# EAGLE design main (EAGLE 7.6.0)
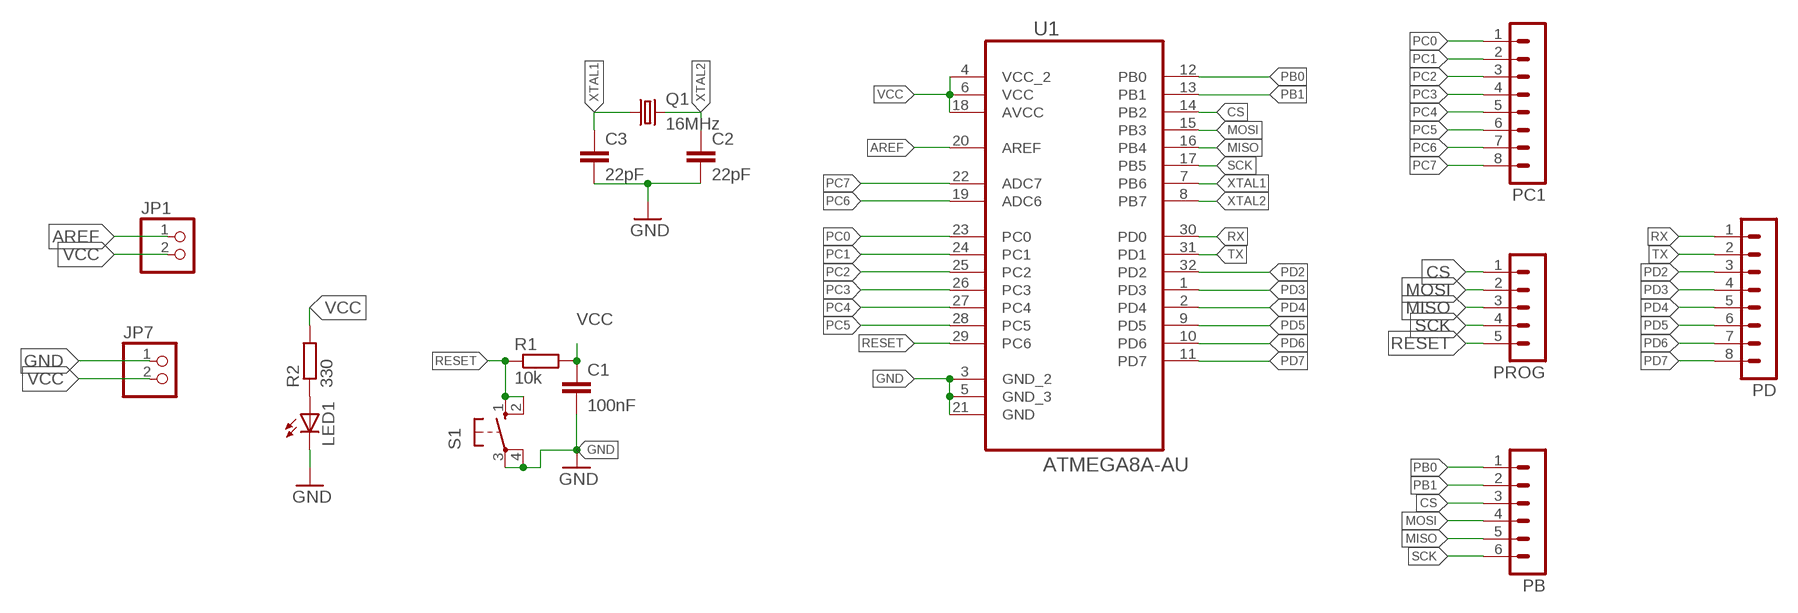
[diagram p0: schematic, sheet 1]

## Parts
C1  100nF  C-EU025-025X050  [C025-025X050]
C2  22pF  C-EU025-025X050  [C025-025X050]
C3  22pF  C-EU025-025X050  [C025-025X050]
JP1  PINHD-1X2  [1X02]
JP7  PINHD-1X2  [1X02]
LED1  LED3MM  [LED3MM]
PB  MA06-1  [MA06-1]
PC1  MA08-1  [MA08-1]
PD  MA08-1  [MA08-1]
PROG  MA05-1  [MA05-1]
Q1  16MHz  CRYSTALHC49S  [HC49/S]
R1  10k  R-EU_M0805  [M0805]
R2  330  R-EU_M0805  [M0805]
S1  10-XX  [B3F-10XX]
U1  ATMEGA8A-AU  [QFP80P900X900X120-32N]

## Nets
AREF: JP1.1 U1.20(AREF)
CS: PB.3 PROG.1 U1.14(PB2)
GND: C1.2 C2.2 C3.2 JP7.1 LED1.K(C) S1.3(P) S1.4(P1) U1.3(GND_2) U1.5(GND_3) U1.21(GND)
MISO: PB.5 PROG.3 U1.16(PB4)
MOSI: PB.4 PROG.2 U1.15(PB3)
N$1: LED1.A R2.1
PB0: PB.1 U1.12(PB0)
PB1: PB.2 U1.13(PB1)
PC0: PC1.1 U1.23(PC0)
PC1: PC1.2 U1.24(PC1)
PC2: PC1.3 U1.25(PC2)
PC3: PC1.4 U1.26(PC3)
PC4: PC1.5 U1.27(PC4)
PC5: PC1.6 U1.28(PC5)
PC6: PC1.7 U1.19(ADC6)
PC7: PC1.8 U1.22(ADC7)
PD2: PD.3 U1.32(PD2)
PD3: PD.4 U1.1(PD3)
PD4: PD.5 U1.2(PD4)
PD5: PD.6 U1.9(PD5)
PD6: PD.7 U1.10(PD6)
PD7: PD.8 U1.11(PD7)
RESET: PROG.5 R1.1 S1.1(S) S1.2(S1) U1.29(PC6)
RX: PD.1 U1.30(PD0)
SCK: PB.6 PROG.4 U1.17(PB5)
TX: PD.2 U1.31(PD1)
VCC: C1.1 JP1.2 JP7.2 R1.2 R2.2 U1.4(VCC_2) U1.6(VCC) U1.18(AVCC)
XTAL1: C3.1 Q1.1 U1.7(PB6)
XTAL2: C2.1 Q1.2 U1.8(PB7)

## Library data of the parts
C1-C3 = resistor:C-EU: CAPACITOR, European symbol
JP1 JP7 = pinhead:PINHD-1X2: PIN HEADER
LED1 = adafruit:LED: LED OSRAM: - CHIPLED LG R971, LG N971, LY N971, LG Q971, LY Q971, LO R971, LY R971 LH N974, LH R974 LS Q976, LO Q976, LY Q976 LO Q996 - Hyper CHIPLED LW Q18S LB Q993, LB Q99A, LB R99A - SideLED LS A670, LO A670, LY A670, LG A670, LP A670 LB A673, LV A673, LT A673, LW A673 LH A674 LY A675 LS A676, LA A676, LO A676, LY A676, LW A676 LS A679, LY A679, LG A679 - Hyper Micro SIDELED® LS Y876, LA Y876, LO Y876, LY Y876 LT Y87S - SmartLED LW L88C, LW L88S LB L89C, LB L89S, LG L890 LS L89K, LO L89K, LY L89K LS L896, LA L896, LO L896, LY L896 - TOPLED LS T670, LO T670, LY T670, LG T670, LP T670 LSG T670, LSP T670, LSY T670, LOP T670, LYG T670 LG T671, LOG T671, LSG T671 LB T673, LV T673, LT T673, LW T673 LH T674 LS T676, LA T676, LO T676, LY T676, LB T676, LH T676, LSB T676, LW T676 LB T67C, LV T67C, LT T67C, LS T67K, LO T67K, LY T67K, LW E67C LS E67B, LA E67B, LO E67B, LY E67B, LB E67C, LV E67C, LT E67C LW T67C LS T679, LY T679, LG T679 LS T770, LO T770, LY T770, LG T770, LP T770 LB T773, LV T773, LT T773, LW T773 LH T774 LS E675, LA E675, LY E675, LS T675 LS T776, LA T776, LO T776, LY T776, LB T776 LHGB T686 LT T68C, LB T68C - Hyper Mini TOPLED® LB M676 - Mini TOPLED Santana® LG M470 LS M47K, LO M47K, LY M47K Source: http://www.osram.convergy.de/
PB = con-lstb:MA06-1: PIN HEADER; OC_FARNELL: unknown; OC_NEWARK: unknown
PC1 PD = con-lstb:MA08-1: PIN HEADER; OC_FARNELL: unknown; OC_NEWARK: unknown
PROG = con-lstb:MA05-1: PIN HEADER; OC_FARNELL: unknown; OC_NEWARK: unknown
Q1 = crystal:CRYSTAL: CRYSTAL; OC_FARNELL: 1667008; OC_NEWARK: unknown
R1 = resistor:R-EU_: RESISTOR, European symbol
R2 = rcl:R-EU_: RESISTOR, European symbol
S1 = switch-omron:10-XX: OMRON SWITCH; MPN: B3F-1000; OC_FARNELL: 176432; OC_NEWARK: 36M3542
U1 = Atmel_By_element14_Batch_1-00:ATMEGA8A-AU: Programmable Flash; MPN: ATMEGA8A-AU; OC_FARNELL: 1748532; OC_NEWARK: 26R5638; PACKAGE: TQFP-32; SUPPLIER: Atmel

## Board
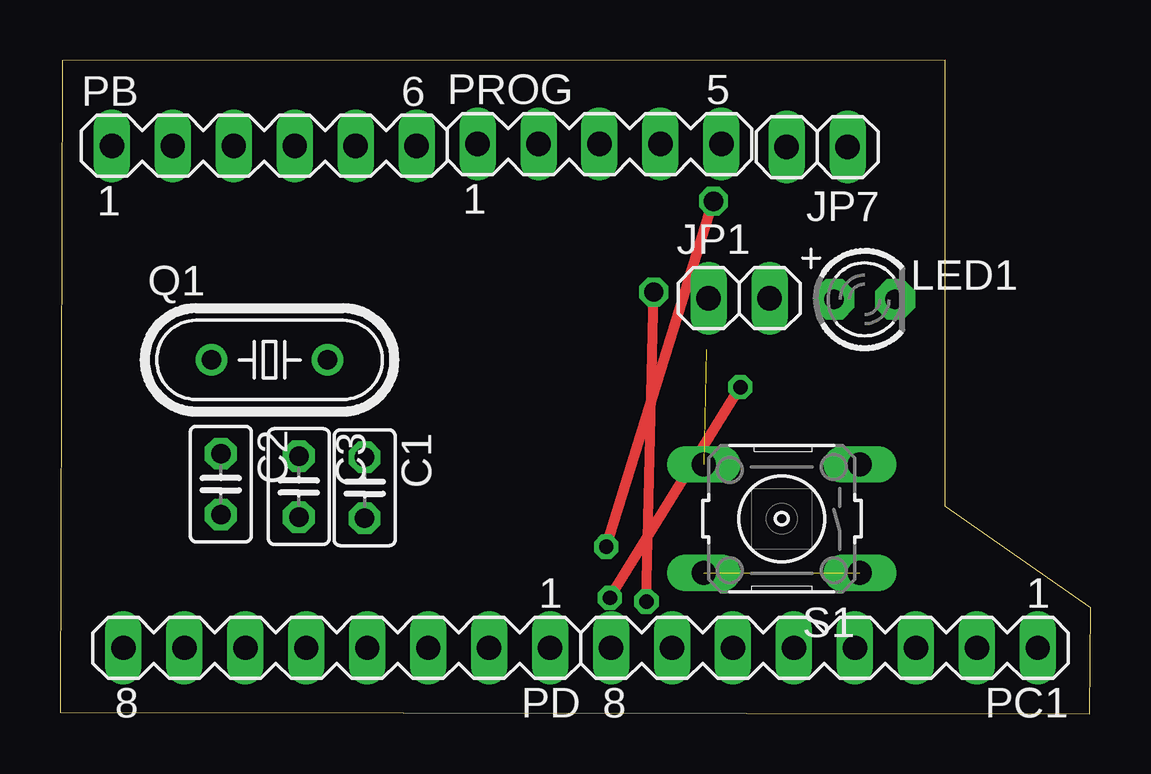
[diagram p1: board, top side]
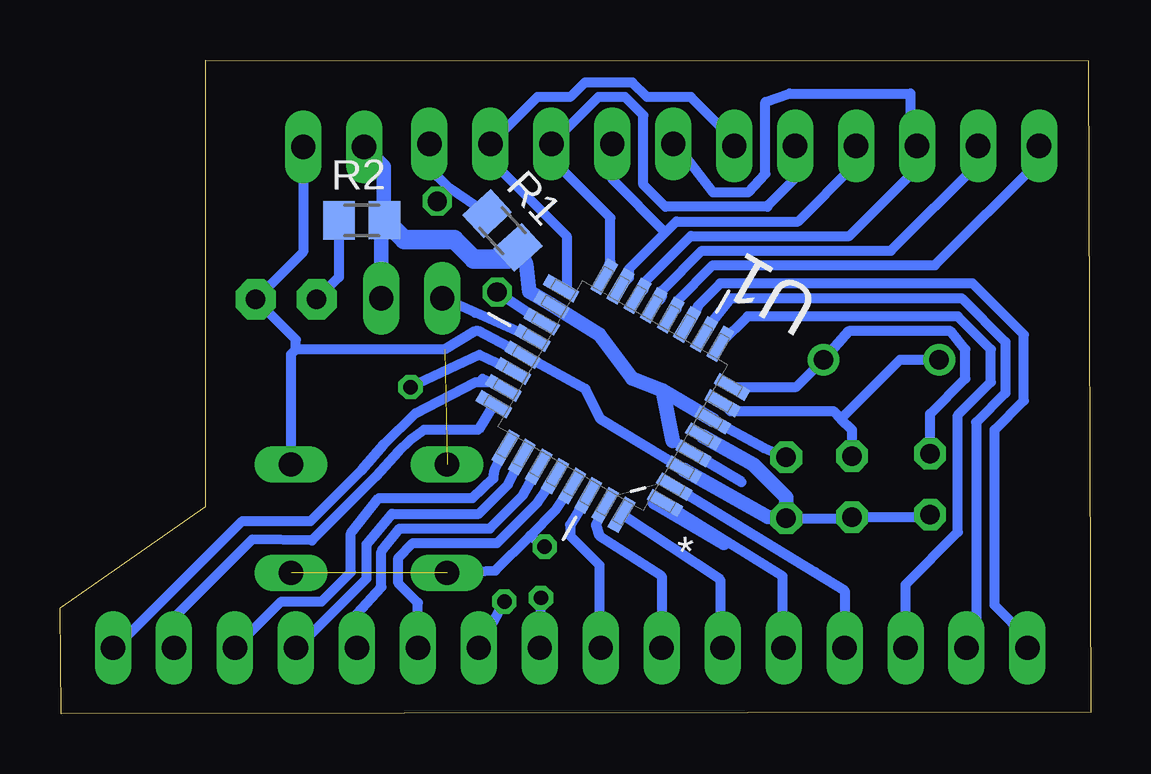
[diagram p2: board, bottom side, seen from below]

Size 42.95 x 27.25 mm. Coordinates in mm from the lower left corner, seen from the top.
Outline: 0,0.05 42.9,0 42.95,4.42 36.88,8.64 36.88,27.25 0.1,27.23 0,0.05
Copper layers (1*16): Top 0.035mm / dielectric 1.5mm / Bottom 0.035mm
Design rules "default": minimum track width 10mil, minimum drill 24mil, track to track 8mil, track to pad 8mil, pad to pad 8mil, via to via 8mil, smd to smd 8mil, copper to edge 40mil, drill to drill 8mil, minimum pad ring 10mil, minimum via ring 8mil, stop-mask expansion 4mil, vias tented up to drill 0mil, thermal gap 10mil

### Footprints (pad centres in the part's own frame; a part is rotated, then mirrored left to right if it is on the bottom)
C025-025X050 = drill 0.813 octagon: 1 -1.27,0; 2 1.27,0
1X02 = drill 1.016 long: 1 -1.27,0; 2 1.27,0
LED3MM = drill 0.813 pad 1.676 octagon: A -1.27,0; K 1.27,0
MA06-1 = drill 1.016 long: 1 -6.35,0; 2 -3.81,0; 3 -1.27,0; 4 1.27,0; 5 3.81,0; 6 6.35,0
MA08-1 = drill 1.016 long: 1 -8.89,0; 2 -6.35,0; 3 -3.81,0; 4 -1.27,0; 5 1.27,0; 6 3.81,0; 7 6.35,0; 8 8.89,0
MA05-1 = drill 1.016 long: 1 -5.08,0; 2 -2.54,0; 3 0,0; 4 2.54,0; 5 5.08,0
HC49/S = drill 0.813: 1 -2.413,0; 2 2.413,0
M0805 = smd 1.3 x 1.6: 1 -0.95,0; 2 0.95,0
B3F-10XX = drill 1.016 long: 1 -3.251,2.261; 2 3.251,2.261; 3 -3.251,-2.261; 4 3.251,-2.261
QFP80P900X900X120-32N = smd 1.473 x 0.508: 1 -4.115,2.794; 2 -4.115,2.007; 3 -4.115,1.194; 4 -4.115,0.406; 5 -4.115,-0.406; 6 -4.115,-1.194; 7 -4.115,-2.007; 8 -4.115,-2.794; 17 4.115,-2.794; 18 4.115,-2.007; 19 4.115,-1.194; 20 4.115,-0.406; 21 4.115,0.406; 22 4.115,1.194; 23 4.115,2.007; 24 4.115,2.794 | smd 0.508 x 1.473: 9 -2.794,-4.115; 10 -2.007,-4.115; 11 -1.194,-4.115; 12 -0.406,-4.115; 13 0.406,-4.115; 14 1.194,-4.115; 15 2.007,-4.115; 16 2.794,-4.115; 25 2.794,4.115; 26 2.007,4.115; 27 1.194,4.115; 28 0.406,4.115; 29 -0.406,4.115; 30 -1.194,4.115; 31 -2.007,4.115; 32 -2.794,4.115

### Placement (x,y rotation side)
C1  12.69,9.42 270 top
C2  6.7,9.57 270 top
C3  9.95,9.47 270 top
JP1  28.3,17.32 0 top
JP7  31.55,23.62 180 top
LED1  33.53,17.27 0 top
PB  8.51,23.67 0 top
PC1  31.85,2.74 180 top
PD  11.53,2.74 180 top
PROG  22.48,23.75 0 top
Q1  8.73,14.75 0 top
R1  24.51,20.14 312.5 bottom
R2  30.38,20.57 0.1 bottom
S1  30.07,8.13 180 top
U1  19.91,13.26 150 bottom

### Tracks (layer width: path | path; a pad name or v marks a point on that pad's centre or on a via)
AREF
  Bottom 0.406: U1.20 25.65,16.71 JP1.1
CS
  Bottom 0.406: U1.14 18.64,17.67 18.64,17.93 16.66,19.91 10.06,19.91 7.21,22.76 7.21,23.65 PB.3 7.52,23.95 7.52,25.86 12.55,25.86 13.56,25.5 13.56,22.5 14.28,21.74 15.75,21.74 17.3,23.75 PROG.1
GND  (1 unrouted)
  Bottom 0.406: C1.2 10,8.15 C3.2 6.8,8.2 C2.2 | U1.3 20.42,12.27 21.06,13.54 U1.21 25.5,15.95 25.65,15.95 26.92,15.19 33.12,15.19 | JP7.1 32.82,19.25 LED1.K 33.12,15.6 33.12,15.19 | S1.3 33.33,14.99 33.12,15.19
  Bottom 0.61: U1.5 14.07,10.39 12.69,9.01 C1.2 13.46,8.2 U1.3
MISO
  Bottom 0.406: U1.16 20.02,18.85 20.02,20.68 22.45,23.11 22.45,23.72 PROG.3 20.52,25.71 19.41,25.71 18.64,24.94 18.64,22.05 17.73,21.13 13.46,21.13 13.46,21.18 12.4,22.25 12.4,23.6 PB.5
MOSI
  Bottom 0.406: 17.73,20.07 17.27,20.52 12.19,20.52 9.86,22.86 9.86,23.6 PB.4 | 17.73,20.07 19.25,18.54 19.25,18.17 U1.15 | 17.73,20.07 19.94,22.28 PROG.2
N$1
  Bottom 0.406: R2.1 31.33,18.2 LED1.A
N$3
  Bottom 0.61: 18.16,8.81 15.29,7.11
PB0
  Bottom 0.406: U1.12 17.27,16.85 17.27,17.17 15.75,18.69 6.5,18.69 2.13,23.06 2.13,23.65 PB.1
PB1
  Bottom 0.406: U1.13 17.88,17.35 17.88,17.63 16.21,19.3 8.33,19.3 4.67,22.96 4.67,23.65 PB.2
PC0
  Bottom 0.406: PC1.1 40.64,2.74 35.36,8.03 32.51,8.03 30.38,10.16 29.46,11.23 28.14,12.52 25.63,13.82 25.03,13.82 | 25.35,13.97 25.03,13.82 | 25.03,13.82 U1.23
PC1
  Bottom 0.406: U1.24 25.53,11.84 27.79,11.83 28.35,11.43 28.85,10.92 29.77,9.91 32.46,7.21 34.95,7.26 38.15,4.06 38.15,2.79 PC1.2
PC2
  Bottom 0.406: PC1.3 33.73,4.67 32.06,4.67 30.84,5.89 30.84,7.52 29.67,8.99 25.76,8.99 24.89,9.8 24.84,10.16 U1.25
PC3
  Bottom 0.406: PC1.4 33.07,2.74 30.18,5.64 30.18,7.06 29.11,8.33 25.5,8.33 24.28,9.55 U1.26
PC4
  Bottom 0.406: PC1.5 30.58,4.17 29.57,5.28 29.57,6.76 28.8,7.72 25.04,7.72 23.67,9.09 U1.27
PC5
  Bottom 0.406: PC1.6 28.04,4.62 28.85,5.44 28.85,6.5 28.25,7.11 24.74,7.11 23.06,8.79 U1.28
PC6  (via drill 0.6, 0.8)
  Top 0.406: v24.44,4.67 v24.74,17.58
  Bottom 0.406: U1.19 v24.74,17.58 | v24.44,4.67 PC1.7
PC7  (via drill 0.6)
  Top 0.406: v22.91,4.83 v28.35,13.61
  Bottom 0.406: v22.91,4.83 PC1.8 | U1.22 25.48,14.96 v28.35,13.61
PD2
  Bottom 0.406: U1.32 15.44,5.59 15.44,2.85 PD.3
PD3
  Bottom 0.406: U1.1 12.85,5.74 12.85,2.79 PD.4
PD4
  Bottom 0.406: U1.2 11.48,5.89 10.26,5.13 PD.5
PD5
  Bottom 0.406: PD.6 7.72,5.39 5.54,7.57 5.54,12.45 4.17,13.82 4.17,15.19 5.54,16.56 14.3,16.56 U1.9
PD6
  Bottom 0.406: U1.10 16.12,15.89 14.99,17.32 5.39,17.32 3.56,15.49 3.56,13.36 4.78,12.14 4.78,3.15 PD.7
PD7
  Bottom 0.406: PD.8 2.64,3.15 4.01,4.52 4.01,11.84 2.79,13.06 2.79,15.8 4.93,17.93 15.44,17.93 16.36,17.02 U1.11
RESET  (via drill 0.6, 0.8 pad 1.02)  (1 unrouted)
  Top 0.406: v22.76,6.96 v27.23,21.36
  Bottom 0.406: S1.2 24.82,5.97 23.37,7.42 | 23.37,7.42 22.3,8.48 U1.29 | PROG.5 27.56,22.72 26.8,21.97 | 26.8,21.97 R1.1 | v27.23,21.36 26.8,21.97 | v22.76,6.96 23.37,7.42
RX
  Bottom 0.406: U1.30 21.69,7.87 21.69,7.42 20.47,6.2 20.47,2.79 PD.1
SCK
  Bottom 0.406: U1.17 21.84,17.72 21.84,19.91 25.02,23.09 PROG.4 23.06,25.71 21.69,25.71 21.08,26.31 19.1,26.31 18.49,25.71 16.66,25.71 14.83,23.88 PB.6
TX
  Bottom 0.406: U1.31 20.63,7.87 20.47,7.42 17.88,5.74 PD.2
VCC
  Bottom 0.406: U1.6 13.61,11.07 C1.1 | 29.57,20.44 R2.2 | U1.4 14.55,9.65 17.42,11.38
  Bottom 0.61: JP7.2 29.46,22.81 29.46,20.61 R2.2 | U1.6 17.83,13.46 | 17.83,13.46 19.1,13.97 20.47,15.8 U1.18 23.39,17.6 23.52,18.72 R1.2 | 17.42,11.38 17.83,13.46 | 29.57,20.44 JP1.2
  Bottom 0.813: R1.2 arc90 24.36,18.95 25.71,18.95 26.52,19.76 28.61,19.76 R2.2
XTAL1
  Bottom 0.406: C3.1 9.95,11.83 10.41,12.29 | 10.41,12.29 10.72,12.6 15.01,12.6 U1.7 | Q1.1 7.96,14.75 10.41,12.29
XTAL2
  Bottom 0.406: U1.8 12.27,13.62 Q1.2 10.1,15.95 5.84,15.95 5.23,15.19 5.23,13.97 6.7,12.5 C2.1